# EAGLE board Welder_PSU (EAGLE 9.6.2), part 1 of 2
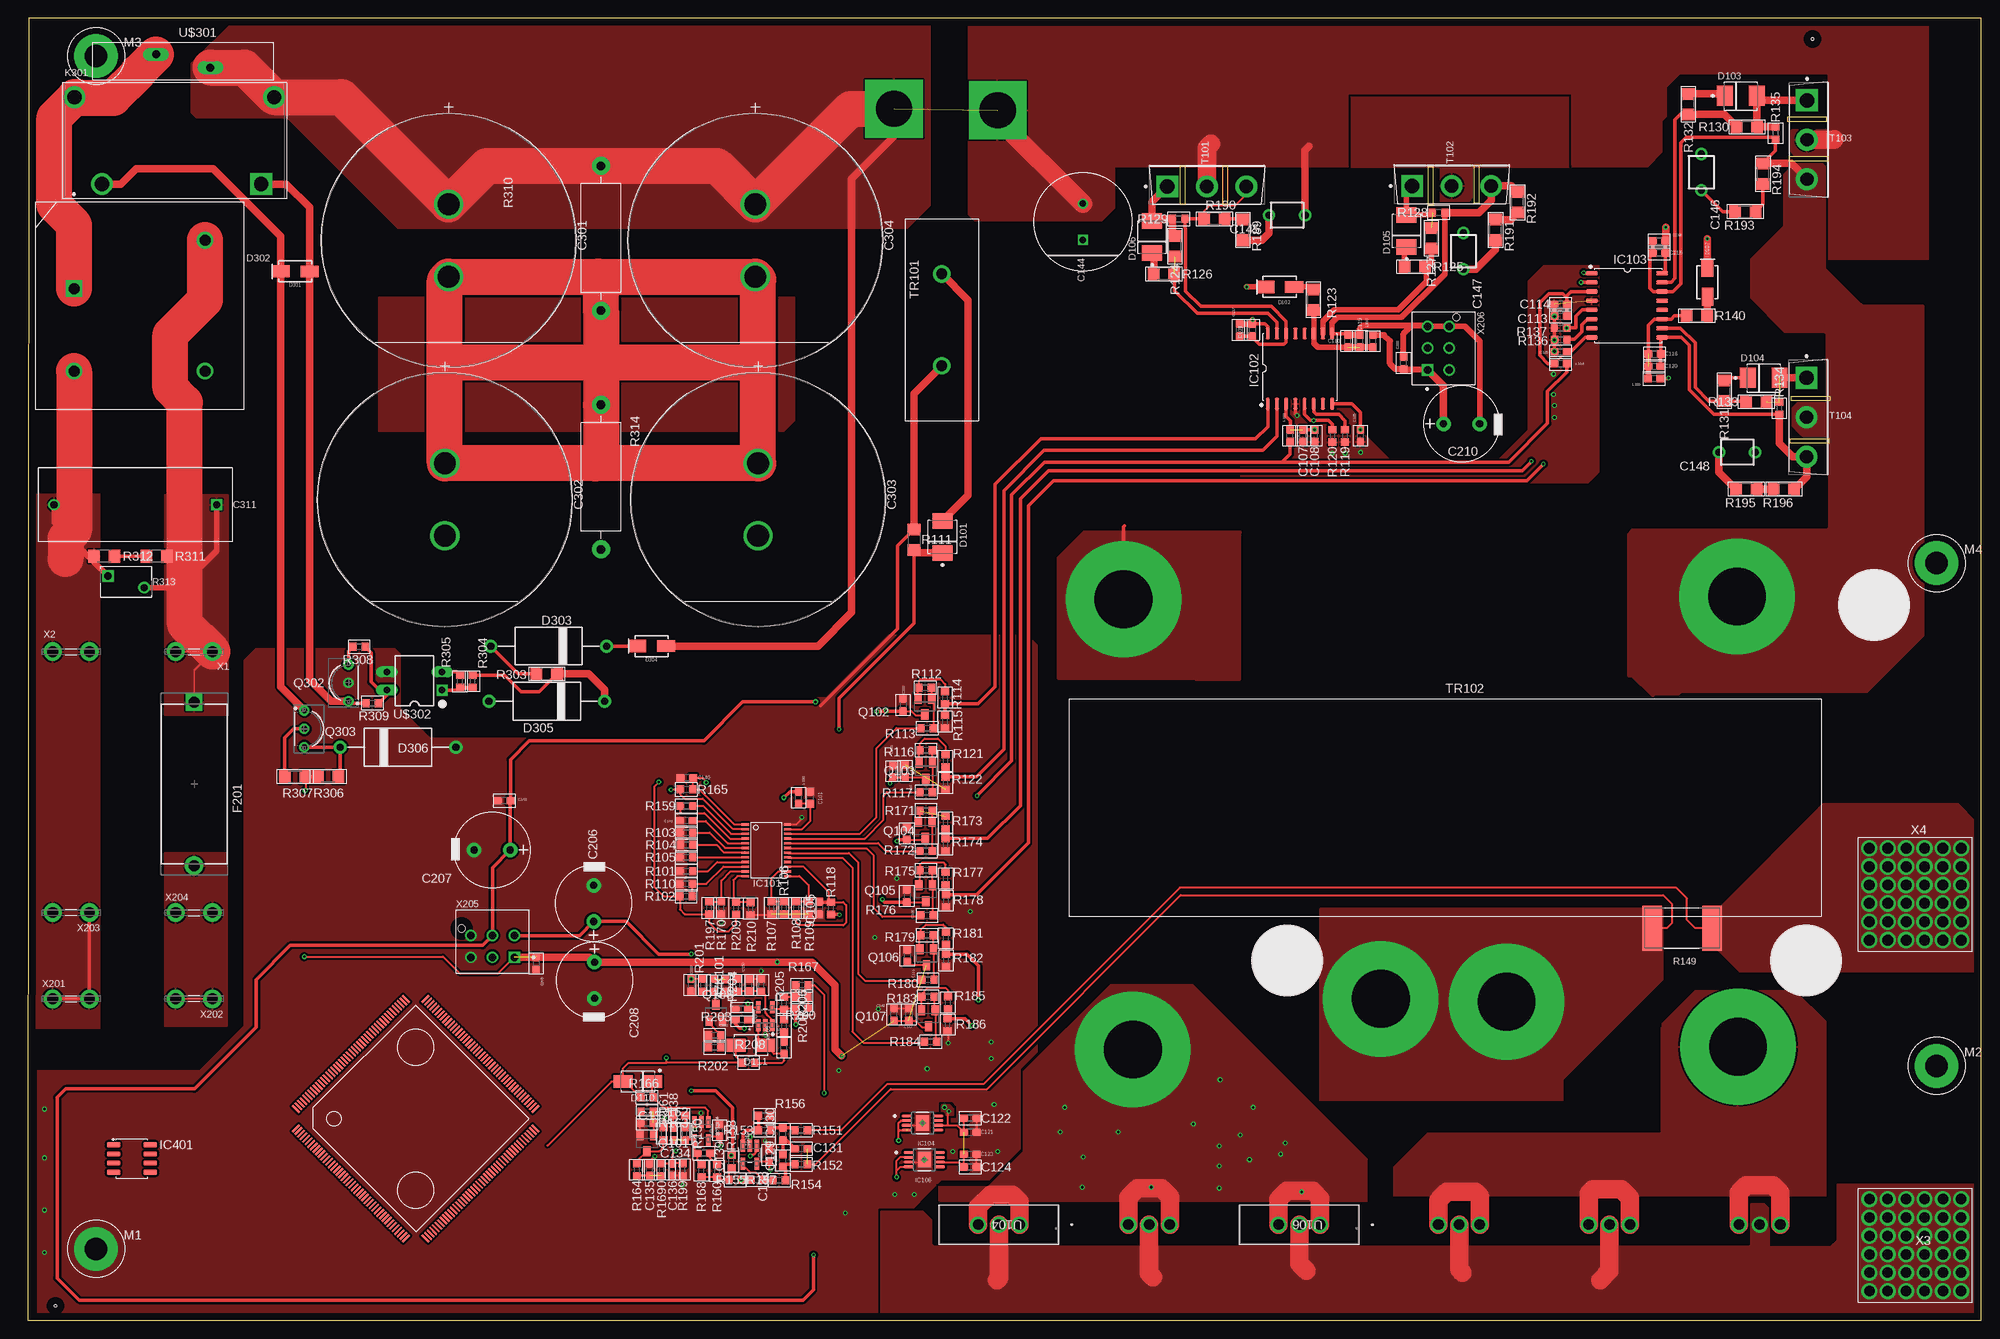
[diagram p6: board, top side]
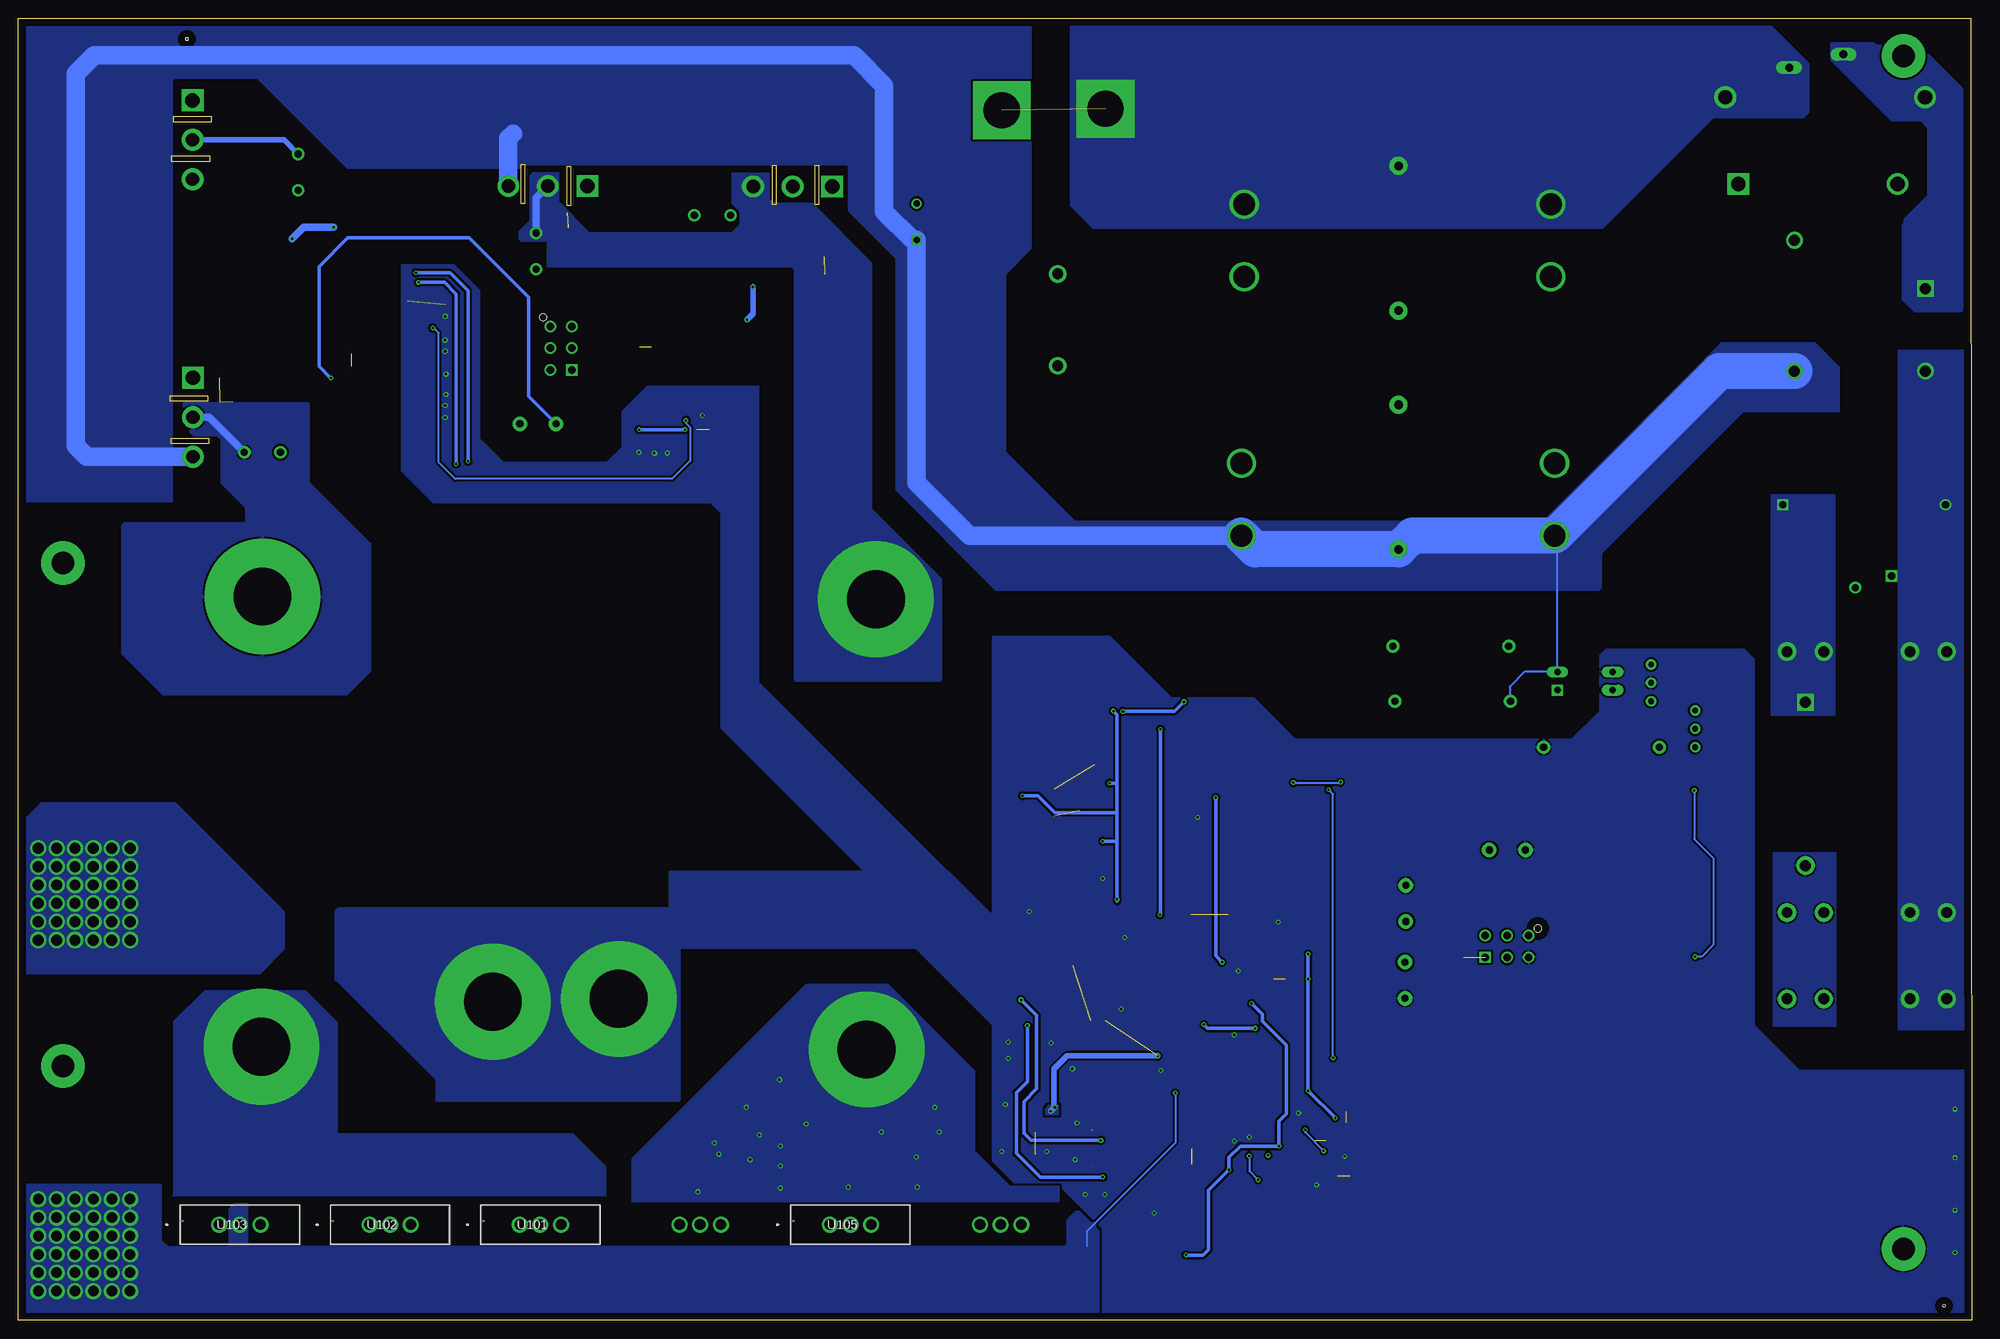
[diagram p7: board, bottom side, seen from below]

Size 270.13 x 180 mm. Coordinates in mm from the lower left corner, seen from the top.
Outline: 0,0.03 270.13,0 270.13,180 0.13,180 0,0.03
Copper layers (1*16): Top 0.07mm / dielectric 1.5mm / Bottom 0.07mm
Design rules "default *": minimum track width 0.2mm, minimum drill 0.3mm, track to track 0.3mm, track to pad 0.3mm, pad to pad 0.3mm, via to via 0.3mm, smd to smd 0mil, copper to edge 40mil, drill to drill 6mil, minimum pad ring 0.2mm, minimum via ring 0.15mm, stop-mask expansion 4mil, vias tented up to drill 0mil, thermal gap 10mil
Net classes: 1 HV-L: clearance 0.254 mm to class 0; 2 HV-N: clearance 0.254 mm to class 0, clearance 1.016 mm to class 1; 3 LV: clearance 0.203 mm to class 0, clearance 1.016 mm to class 1, clearance 1.016 mm to class 2; 4 HV-Plus: clearance 0.254 mm to class 0, clearance 1.016 mm to class 1, clearance 1.016 mm to class 2, clearance 1.016 mm to class 3; 5 HV-Minus: clearance 0.254 mm to class 0, clearance 1.016 mm to class 1, clearance 1.016 mm to class 2, clearance 1.016 mm to class 3, clearance 1.016 mm to class 4
Holes 0.35 mm at 246.76,177.16 3.81,2.03
Milling: 32 lines

## Footprints (pad centres in the part's own frame; a part is rotated, then mirrored left to right if it is on the bottom)
R0603 = smd 1 x 1.1: 1 -0.85,0; 2 0.85,0
0603 = smd 1.1 x 1: 1 -0.85,0; 2 0.85,0
C0603 = smd 1.1 x 1: 1 -0.85,0; 2 0.85,0
RADIAL_D13.0P5.0H25.0 = drill 0.9 pad 1.4 square: 1 -2.5,0 | drill 0.9 pad 1.4: 2 2.5,0
CAP_DISC_P5H13 = drill 1 pad 1.7: 1 -2.5,0; 2 2.5,0
CAPACITOR-ELKO-RM5-10X16 = drill 1 pad 2: 1 -2.5,0; 2 2.5,0
CAP_SLP152M250H9P3_MODIFIED = drill 3 pad 3.8: 1 0,0; 2 10.008,0
KEMET_R49AN347050B1M_0 = drill 1 pad 1.55 square: 1 -11.25,0 | drill 1 pad 1.55: 2 11.25,0
SMB = smd 2.159 x 2.743: 1 -2.21,0; 2 2.21,0
SMA-DIODE = smd 2.5 x 1.6: A -2,0 | smd 2.5 x 1.7: C 2,0
SMA = smd 2.65 x 1.75: 1 -2.015,0; 2 2.015,0
GBPC3510W_MODIFIED = drill 1.5 pad 2.3 square: 1 -2.35,-9.05 | drill 1.5 pad 2.3: 2 9.05,-9.05; 3 9.05,9.05; 4 -9.05,9.05
DO-201AD = drill 1 pad 1.8: A -8,0; K 8,0
FUSE_RM22.6 = drill 1.5 pad 2.3 square: 1 -11.3,0 | drill 1.5 pad 2.54: 2 11.3,0
TSSOP24 = smd 0.305 x 0.991: 1 -3.575,-2.918; 2 -2.925,-2.918; 3 -2.275,-2.918; 4 -1.625,-2.918; 5 -0.975,-2.918; 6 -0.325,-2.918; 7 0.325,-2.918; 8 0.975,-2.918; 9 1.625,-2.918; 10 2.275,-2.918; 11 2.925,-2.918; 12 3.575,-2.918; 13 3.575,2.918; 14 2.925,2.918; 15 2.275,2.918; 16 1.625,2.918; 17 0.975,2.918; 18 0.325,2.918; 19 -0.325,2.918; 20 -0.975,2.918; 21 -1.625,2.918; 22 -2.275,2.918; 23 -2.925,2.918; 24 -3.575,2.918
SOIC16_HV = smd 1.65 x 0.6: 1 -4.855,4.445; 2 -4.855,3.175; 3 -4.855,1.905; 4 -4.855,0.635; 5 -4.855,-0.635; 6 -4.855,-1.905; 7 -4.855,-3.175; 8 -4.855,-4.445; 9 4.855,-4.445; 10 4.855,-3.175; 11 4.855,-1.905; 12 4.855,-0.635; 13 4.855,0.635; 14 4.855,1.905; 15 4.855,3.175; 16 4.855,4.445
VSSOP-8 = smd 1.4 x 0.45: 1 -2.151,0.975; 2 -2.151,0.325; 3 -2.151,-0.325; 4 -2.151,-0.975; 5 2.151,-0.975; 6 2.151,-0.325; 7 2.151,0.325; 8 2.151,0.975 | smd 1.8 x 2.15: 3-2 0,0
SOT-23-5 = smd 1.626 x 0.61: 1 -1.245,0.95; 2 -1.245,0; 3 -1.245,-0.95; 4 1.245,-0.95; 5 1.245,0.95
SOIC8 = smd 1.9 x 0.72: 1 -2.54,1.905; 2 -2.54,0.635; 3 -2.54,-0.635; 4 -2.54,-1.905; 5 2.54,-1.905; 6 2.54,-0.635; 7 2.54,0.635; 8 2.54,1.905
PANASONIC_ALFG2PF09_0_MODIFIED = drill 2 pad 2.6 square: 1 0,0 | drill 2 pad 2.6: 2 22,0; 3 -1.8,-12; 4 25.8,-12
PCB_SCREW_M3_POWER = drill 3.1 pad 6: 1 0,0
THT_PAD_D5.0 = drill 5 pad 8 square: P$1 0,0
SOT23 = smd 1 x 1.4: 1 -0.95,-1.1; 2 0.95,-1.1; 3 0,1.1
TO-92 = drill 0.8 pad 1.4: 1 0,2.54; 2 0,0; 3 0,-2.54
R1206 = smd 1.6 x 1.803: 1 -1.422,0; 2 1.422,0
WSLP3921 = smd 2.7 x 6.2: 1 -4.15,0; 2 4.15,0
RES-RM20-RSF3W = drill 1.2 pad 2.5: 1 -10,0; 2 10,0
EPCOS_B72205S0271K101_MODIFIED = drill 1 pad 1.6 square: 1 -2.5,0.8 | drill 1 pad 1.6: 2 2.5,-0.8
TO-247AC_MODIFIED = drill 2 pad 3 square: 1 -0.227,5.46 | drill 1.85 pad 3: 2 -0.227,0; 3 -0.227,-5.46
CST206-2A_MODIFIED = drill 1.5 pad 2.4: 1 -6.35,0; 2 6.35,0
TOROID_B64290A0705X830 = drill 8 pad 16: 1 -29.21,40.386; 2 -28.829,-44.45; 3 33.02,40.513; 4 26.797,8.509; 5 26.416,-8.89; 6 33.401,-43.18
TO-247AD_VIS = drill 1.473 pad 1.981: 1 0,0; 2 2.845,0; 3 5.715,0
LQFP176_24X24 = smd 1.372 x 0.254: 1 -12.675,10.75; 2 -12.675,10.25; 3 -12.675,9.75; 4 -12.675,9.25; 5 -12.675,8.75; 6 -12.675,8.25; 7 -12.675,7.75; 8 -12.675,7.25; 9 -12.675,6.75; 10 -12.675,6.25; 11 -12.675,5.75; 12 -12.675,5.25; 13 -12.675,4.75; 14 -12.675,4.25; 15 -12.675,3.75; 16 -12.675,3.25; 17 -12.675,2.75; 18 -12.675,2.25; 19 -12.675,1.75; 20 -12.675,1.25; 21 -12.675,0.75; 22 -12.675,0.25; 23 -12.675,-0.25; 24 -12.675,-0.75; 25 -12.675,-1.25; 26 -12.675,-1.75; 27 -12.675,-2.25; 28 -12.675,-2.75; 29 -12.675,-3.25; 30 -12.675,-3.75; 31 -12.675,-4.25; 32 -12.675,-4.75; 33 -12.675,-5.25; 34 -12.675,-5.75; 35 -12.675,-6.25; 36 -12.675,-6.75; 37 -12.675,-7.25; 38 -12.675,-7.75; 39 -12.675,-8.25; 40 -12.675,-8.75; 41 -12.675,-9.25; 42 -12.675,-9.75; 43 -12.675,-10.25; 44 -12.675,-10.75; 89 12.675,-10.75; 90 12.675,-10.25; 91 12.675,-9.75; 92 12.675,-9.25; 93 12.675,-8.75; 94 12.675,-8.25; 95 12.675,-7.75; 96 12.675,-7.25; 97 12.675,-6.75; 98 12.675,-6.25; 99 12.675,-5.75; 100 12.675,-5.25; 101 12.675,-4.75; 102 12.675,-4.25; 103 12.675,-3.75; 104 12.675,-3.25; 105 12.675,-2.75; 106 12.675,-2.25; 107 12.675,-1.75; 108 12.675,-1.25; 109 12.675,-0.75; 110 12.675,-0.25; 111 12.675,0.25; 112 12.675,0.75; 113 12.675,1.25; 114 12.675,1.75; 115 12.675,2.25; 116 12.675,2.75; 117 12.675,3.25; 118 12.675,3.75; 119 12.675,4.25; 120 12.675,4.75; 121 12.675,5.25; 122 12.675,5.75; 123 12.675,6.25; 124 12.675,6.75; 125 12.675,7.25; 126 12.675,7.75; 127 12.675,8.25; 128 12.675,8.75; 129 12.675,9.25; 130 12.675,9.75; 131 12.675,10.25; 132 12.675,10.75 | smd 0.254 x 1.372: 45 -10.75,-12.675; 46 -10.25,-12.675; 47 -9.75,-12.675; 48 -9.25,-12.675; 49 -8.75,-12.675; 50 -8.25,-12.675; 51 -7.75,-12.675; 52 -7.25,-12.675; 53 -6.75,-12.675; 54 -6.25,-12.675; 55 -5.75,-12.675; 56 -5.25,-12.675; 57 -4.75,-12.675; 58 -4.25,-12.675; 59 -3.75,-12.675; 60 -3.25,-12.675; 61 -2.75,-12.675; 62 -2.25,-12.675; 63 -1.75,-12.675; 64 -1.25,-12.675; 65 -0.75,-12.675; 66 -0.25,-12.675; 67 0.25,-12.675; 68 0.75,-12.675; 69 1.25,-12.675; 70 1.75,-12.675; 71 2.25,-12.675; 72 2.75,-12.675; 73 3.25,-12.675; 74 3.75,-12.675; 75 4.25,-12.675; 76 4.75,-12.675; 77 5.25,-12.675; 78 5.75,-12.675; 79 6.25,-12.675; 80 6.75,-12.675; 81 7.25,-12.675; 82 7.75,-12.675; 83 8.25,-12.675; 84 8.75,-12.675; 85 9.25,-12.675; 86 9.75,-12.675; 87 10.25,-12.675; 88 10.75,-12.675; 133 10.75,12.675; 134 10.25,12.675; 135 9.75,12.675; 136 9.25,12.675; 137 8.75,12.675; 138 8.25,12.675; 139 7.75,12.675; 140 7.25,12.675; 141 6.75,12.675; 142 6.25,12.675; 143 5.75,12.675; 144 5.25,12.675; 145 4.75,12.675; 146 4.25,12.675; 147 3.75,12.675; 148 3.25,12.675; 149 2.75,12.675; 150 2.25,12.675; 151 1.75,12.675; 152 1.25,12.675; 153 0.75,12.675; 154 0.25,12.675; 155 -0.25,12.675; 156 -0.75,12.675; 157 -1.25,12.675; 158 -1.75,12.675; 159 -2.25,12.675; 160 -2.75,12.675; 161 -3.25,12.675; 162 -3.75,12.675; 163 -4.25,12.675; 164 -4.75,12.675; 165 -5.25,12.675; 166 -5.75,12.675; 167 -6.25,12.675; 168 -6.75,12.675; 169 -7.25,12.675; 170 -7.75,12.675; 171 -8.25,12.675; 172 -8.75,12.675; 173 -9.25,12.675; 174 -9.75,12.675; 175 -10.25,12.675; 176 -10.75,12.675
VARISTOR_D25_P7.5 = drill 1.1 pad 1.8 long: 1 -3.75,0.925; 2 3.75,-0.925
DIP04 = drill 0.9 pad 1.5 square: 1 -3.81,1.27 | drill 0.9 pad 1.5 long: 2 -3.81,-1.27; 3 3.81,-1.27; 4 3.81,1.27
TE_726386-2_MODIFIED = drill 1.5 pad 2.54: 1 -2.54,0; 1-2 2.54,0
X01_M10_7461061 = drill 1.45 pad 2.2: 1 -6.35,-6.35; 1-1 -3.81,-6.35; 1-2 -1.27,-6.35; 1-3 1.27,-6.35; 1-4 -6.35,-3.81; 1-5 -3.81,-3.81; 1-6 -1.27,-3.81; 1-7 1.27,-3.81; 1-8 -6.35,-1.27; 1-9 -3.81,-1.27; 1-10 -1.27,-1.27; 1-11 1.27,-1.27; 1-12 -6.35,1.27; 1-13 -3.81,1.27; 1-14 -1.27,1.27; 1-15 1.27,1.27; 1-16 3.81,-6.35; 1-17 3.81,-3.81; 1-18 3.81,-1.27; 1-19 3.81,1.27; 1-20 3.81,3.81; 1-21 1.27,3.81; 1-22 -1.27,3.81; 1-23 -3.81,3.81; 1-24 -6.35,3.81; 1-25 6.35,-1.27; 1-26 6.35,-3.81; 1-27 6.35,-6.35; 1-28 6.35,1.27; 1-29 6.35,3.81; 1-30 -6.35,6.35; 1-31 -3.81,6.35; 1-32 -1.27,6.35; 1-33 1.27,6.35; 1-34 3.81,6.35; 1-35 6.35,6.35
X01_M10_7461061_MODIFIED = drill 1.5 pad 2.25: 1 -6.35,-6.35; 1-1 -3.81,-6.35; 1-2 -1.27,-6.35; 1-3 1.27,-6.35; 1-4 -6.35,-3.81; 1-5 -3.81,-3.81; 1-6 -1.27,-3.81; 1-7 1.27,-3.81; 1-8 -6.35,-1.27; 1-9 -3.81,-1.27; 1-10 -1.27,-1.27; 1-11 1.27,-1.27; 1-12 -6.35,1.27; 1-13 -3.81,1.27; 1-14 -1.27,1.27; 1-15 1.27,1.27; 1-16 3.81,-6.35; 1-17 3.81,-3.81; 1-18 3.81,-1.27; 1-19 3.81,1.27; 1-20 3.81,3.81; 1-21 1.27,3.81; 1-22 -1.27,3.81; 1-23 -3.81,3.81; 1-24 -6.35,3.81; 1-25 6.35,-1.27; 1-26 6.35,-3.81; 1-27 6.35,-6.35; 1-28 6.35,1.27; 1-29 6.35,3.81; 1-30 -6.35,6.35; 1-31 -3.81,6.35; 1-32 -1.27,6.35; 1-33 1.27,6.35; 1-34 3.81,6.35; 1-35 6.35,6.35
MOLEX_206832-0601 = drill 1.02 pad 1.57 square: 1 3,-2.2 | drill 1.02 pad 1.57: 2 3,0.8; 3 0,-2.2; 4 0,0.8; 5 -3,-2.2; 6 -3,0.8 | hole 1.02: -4.28,1.78

## Placement (x,y rotation side)
47K101  [R0603]  98.11,46.35 90 top
C101  1µF/25V  [0603]  108.2,72.26 90 top
C102  100nF/50V  [0603]  121.03,85.09 270 top
C103  100nF/50V  [0603]  121.28,75.94 270 top
C104  100nF/50V  [0603]  121.54,67.31 270 top
C105  1nF 50V  [C0603]  109.47,57.02 270 top
C106  100nF/50V  [0603]  121.54,58.67 270 top
C107  100nF/100V  [0603]  176.33,122.3 90 top
C108  1uF/35V  [0603]  177.92,122.3 90 top
C109  2.2µF/25V  [0603]  169.29,136.91 270 top
C110  2.2µF/25V  [0603]  182.53,135.38 90 top
C111  100nF/50V  [0603]  121.59,50.42 270 top
C112  100nF/50V  [0603]  121.8,42.3 270 top
C113  100nF/100V  [0603]  211.96,138.85 0 top
C114  100nF/100V  [0603]  211.93,140.5 0 top
C115  2.2µF/25V  [0603]  225.55,147.57 180 top
C116  2.2µF/25V  [0603]  224.93,133.61 0 top
C117  100nF/100V  [0603]  167.56,136.9 90 top
C118  100nF/16V  [0603]  225.55,149.22 0 top
C119  2.2µF/25V  [0603]  184.2,135.38 90 top
C120  2.2µF/25V  [0603]  224.91,131.9 0 top
C121  1µF/25V  [0603]  130.3,26.04 0 top
C122  100nF/16V  [0603]  130.3,27.94 180 top
C123  1µF/25V  [0603]  130.3,22.99 0 top
C124  100nF/16V  [0603]  130.3,21.21 180 top
C125  100nF/100V  [0603]  184.25,122.3 90 top
C126  1uF/35V  [0603]  211.96,133.9 0 top
C129  1nF 50V  [0603]  104.39,22.1 90 top
C130  1nF 50V  [0603]  104.39,25.78 90 top
C131  100pF 50V  [0603]  106.93,23.75 180 top
C132  1nF 50V  [0603]  107,43.15 180 top
C133  100nF/16V  [0603]  102.49,22.86 90 top
C134  1nF 50V  [0603]  93.47,23.11 180 top
C135  100nF 50V  [0603]  85.98,20.83 90 top
C136  220nF 50V  [0603]  89.15,20.83 270 top
C137  1nF 50V  [0603]  90.04,28.32 0 top
C138  1nF 50V  [0603]  89.28,25.78 270 top
C139  100nF 25V  [0603]  95.63,26.29 90 top
C140  1µF/25V  [0603]  91.13,75 180 top
C141  100nF/100V  [0603]  91.06,69.09 180 top
C142  1uF/25V  [0603]  119.76,42.29 90 top
C143  1uF/25V  [0603]  65.89,71.86 180 top
C144  860011378008  [RADIAL_D13.0P5.0H25.0]  145.89,151.88 90 top
C145  FG26X7R2J472KNT06  [CAP_DISC_P5H13]  174.12,152.78 180 top
C146  FG26X7R2J472KNT06  [CAP_DISC_P5H13]  231.39,158.75 270 top
C147  FG26X7R2J472KNT06  [CAP_DISC_P5H13]  198.5,147.83 270 top
C148  FG26X7R2J472KNT06  [CAP_DISC_P5H13]  236.35,120.02 180 top
C149  100nF 50V  [0603]  96.44,46.3 270 top
C150  220nF 50V  [0603]  99.75,46.35 90 top
C151  1nF 50V  [0603]  104.57,37.69 90 top
C152  1nF 50V  [0603]  98.7,41.61 180 top
C153  10nF 25V  [0603]  98.7,43.03 180 top
C201  100nF/ 100V  [0603]  119.63,75.93 90 top
C202  100nF/ 100V  [0603]  91.69,46.35 270 top
C203  100nF/ 100V  [0603]  190.22,132.36 90 top
C205  100nF/ 100V  [0603]  70.28,49.36 270 top
C206  50PX470MEFC10X20  [CAPACITOR-ELKO-RM5-10X16]  78.23,57.66 90 top
C207  50PX470MEFC10X20  [CAPACITOR-ELKO-RM5-10X16]  64.2,65.05 180 top
C208  50PX470MEFC10X20  [CAPACITOR-ELKO-RM5-10X16]  78.36,47.03 270 top
C210  50PX470MEFC10X20  [CAPACITOR-ELKO-RM5-10X16]  198.25,123.95 0 top
C301  C_1500UFCAP_SLP152M250H9P3_MODIFIED  [CAP_SLP152M250H9P3_MODIFIED]  58.17,154.31 270 top
C302  C_1500UFCAP_SLP152M250H9P3_MODIFIED  [CAP_SLP152M250H9P3_MODIFIED]  57.66,118.49 270 top
C303  C_1500UFCAP_SLP152M250H9P3_MODIFIED  [CAP_SLP152M250H9P3_MODIFIED]  100.96,118.49 270 top
C304  C_1500UFCAP_SLP152M250H9P3_MODIFIED  [CAP_SLP152M250H9P3_MODIFIED]  100.58,154.31 270 top
C311  R49AN347050B1MKEMET_R49AN347050B1M_0_0  [KEMET_R49AN347050B1M_0]  14.86,112.78 180 top
D101  STTH1R04U  [SMB]  126.47,108.32 90 top
D102  RS1M-13-F  [SMA-DIODE]  173.1,142.88 180 top
D103  STTH1R04U  [SMB]  236.86,169.29 0 top
D104  STTH1R04U  [SMB]  240.03,130.3 0 top
D105  STTH1R04U  [SMB]  190.63,150.62 90 top
D106  STTH1R04U  [SMB]  155.45,149.75 90 top
D107  RS1M-13-F  [SMA-DIODE]  232.23,143.54 90 top
D110  SS14  [SMA]  84.33,33.02 180 top
D111  SS14  [SMA]  99.95,38.05 180 top
D301  RS1M-13-F  [SMA-DIODE]  36.96,145.03 180 top
D302  GBPC3510W1.5MM_DRILL  [GBPC3510W_MODIFIED]  15.44,140.28 270 top
D303  1N5387BRLG  [DO-201AD]  72.01,93.22 0 top
D304  RS1M-13-F  [SMA-DIODE]  86.23,93.22 180 top
D305  BZX79C9V1  [DO-201AD]  71.75,85.6 0 top
D306  BZX79C9V1  [DO-201AD]  51.18,79.25 180 top
F201  696101000002  [FUSE_RM22.6]  22.99,74.17 270 top
IC101  UCC28951PWR  [TSSOP24]  102.13,65 270 top
IC102  UCC21542DWK  [SOIC16_HV]  175.9,131.57 90 top
IC103  UCC21542DWK  [SOIC16_HV]  221.13,140.33 0 top
IC104  UCC27524DGNVSS  [VSSOP-8]  123.7,27.3 0 top
IC105  OPA378AIDBVR  [SOT-23-5]  101.98,42.04 90 top
IC106  UCC27524DGNVSS  [VSSOP-8]  123.95,22.23 0 top
IC108  OPA378AIDBVR  [SOT-23-5]  93.13,26.2 270 top
IC401  SN65HVD3082EDR  [SOIC8]  14.39,22.39 0 top
K301  PANASONIC_ALFG2PF09_MODIFIED  [PANASONIC_ALFG2PF09_0_MODIFIED]  32.26,157.1 180 top
L102  BLM18RK601SN1D  [0603]  174.54,122.3 90 top
L103  BLM18RK601SN1D  [0603]  185.98,135.38 90 top
L104  BLM18RK601SN1D  [0603]  211.94,132.28 0 top
L105  BLM18RK601SN1D  [0603]  224.88,130.21 180 top
L108  BLM18RK601SN1D  [0603]  106.56,72.26 90 top
M1  M_HOLE_3M  [PCB_SCREW_M3_POWER]  9.43,9.9 0 top
M2  M_HOLE_3M  [PCB_SCREW_M3_POWER]  263.93,35.2 0 top
M3  M_HOLE_3M  [PCB_SCREW_M3_POWER]  9.43,174.8 0 top
M4  M_HOLE_3M  [PCB_SCREW_M3_POWER]  263.93,104.7 0 top
PAD101  THT_PAD_5MM  [THT_PAD_D5.0]  119.76,167.5 90 top
PAD102  THT_PAD_5MM  [THT_PAD_D5.0]  134.11,167.29 0 top
Q101  2N7002  [SOT23]  85.6,24.51 180 top
Q102  2N7002  [SOT23]  124.03,84.87 180 top
Q103  2N7002  [SOT23]  124.15,75.99 180 top
Q104  2N7002  [SOT23]  124.08,67.82 180 top
Q105  2N7002  [SOT23]  124.14,59.07 180 top
Q106  2N7002  [SOT23]  124.27,50.21 180 top
Q107  2N7002  [SOT23]  124.52,41.79 180 top
Q108  2N7002  [SOT23]  95.12,42.55 0 top
Q302  KSD1616AYTA  [TO-92]  38.23,81.79 0 top
Q303  BC640TA  [TO-92]  44.32,88.14 180 top
R101  100K 1%  [R0603]  91.06,62.1 180 top
R102  100K 1%  [R0603]  91.01,58.65 0 top
R103  10K 1%  [R0603]  91.06,67.44 0 top
R104  10K 1%  [R0603]  91.08,65.74 0 top
R105  100K 1%  [R0603]  91.06,64.03 0 top
R106  0R 1%  [R0603]  104.55,57.02 90 top
R107  10K 1%  [R0603]  102.82,57.03 90 top
R108  0R 1%  [R0603]  106.25,57.02 90 top
R109  10K 1%  [R0603]  107.95,57.02 90 top
R110  49K9 1%  [R0603]  91.03,60.35 0 top
R111  10R 1%  [R1206]  122.53,107.95 90 top
R112  100R 1%  [R0603]  124.07,87.47 180 top
R113  10R 1%  [R0603]  124.35,81.87 0 top
R114  330R  [R0603]  126.83,86.1 90 top
R115  10K 1%  [R0603]  126.83,82.8 270 top
R116  100R 1%  [R0603]  124.2,78.84 180 top
R117  10R 1%  [R0603]  124.2,73.05 0 top
R118  22R 1%  [R0603]  111.03,56.97 270 top
R119  10K  [R0603]  182.13,122.3 270 top
R120  10K  [R0603]  180.38,122.28 270 top
R121  330R  [R0603]  126.86,77.35 90 top
R122  10K 1%  [R0603]  126.89,74.29 270 top
R123  2R2 1%  [R1206]  177.76,141.1 90 top
R124  2R2 1%  [R1206]  158.63,148.49 270 top
R125  2R2 1%  [R1206]  191.77,145.67 0 top
R126  2R2 1%  [R1206]  157.1,144.65 0 top
R127  2R2 1%  [R1206]  194.06,149.61 270 top
R128  49K9  [R0603]  195.07,153.16 180 top
R129  49K9  [R0603]  159.13,152.27 180 top
R130  2R2 1%  [R1206]  237.71,165 180 top
R131  2R2 1%  [R1206]  234.57,128.52 270 top
R132  2R2 1%  [R1206]  229.62,168.15 270 top
R133  2R2 1%  [R1206]  239.01,127 180 top
R134  49K9  [R0603]  242.19,126.11 90 top
R135  49K9  [R0603]  241.66,164.12 90 top
R136  10K  [R0603]  211.96,135.55 180 top
R137  10K  [R0603]  211.93,137.2 180 top
R140  2R2 1%  [R1206]  230.77,138.9 0 top
R149  WSL5931L3000FEA  [WSLP3921]  228.73,54.23 0 top
R150  100k 1%  [R0603]  90.8,25.78 90 top
R151  590R 1%  [R0603]  106.93,26.29 0 top
R152  590R 1%  [R0603]  106.93,21.57 0 top
R153  412R 1%  [R0603]  101.85,26.29 180 top
R154  412R 1%  [R0603]  103.89,19.39 180 top
R155  47K 1%  [R0603]  100.84,19.43 0 top
R156  47K 1%  [R0603]  101.85,28.32 180 top
R157  1K2 1%  [R0603]  97.79,19.43 0 top
R158  10K 1%  [R0603]  97.27,21.97 270 top
R159  0R 1%  [R0603]  91.06,71.12 180 top
R160  [R0603]  95.28,20.68 270 top
R161  1k  [R0603]  87.91,25.83 90 top
R162  10K 1%  [R0603]  85.63,28.83 180 top
R163  10K 1%  [R0603]  85.63,27.3 0 top
R164  100K  [R0603]  84.2,20.83 90 top
R165  18K 1%  [R0603]  91.06,73.41 180 top
R166  0R 1%  [R0603]  85.6,30.86 0 top
R167  1K2 1%  [R0603]  107.03,46.35 0 top
R168  18k 1%  [R0603]  93.13,20.7 90 top
R170  10k 1%  [R0603]  95.88,57.02 90 top
R171  100R 1%  [R0603]  124.2,70.48 180 top
R172  10R 1%  [R0603]  124.2,64.9 0 top
R173  330R  [R0603]  126.89,68.84 90 top
R174  10K 1%  [R0603]  126.87,65.78 270 top
R175  100R 1%  [R0603]  124.2,62.25 180 top
R176  10R 1%  [R0603]  124.33,55.99 0 top
R177  330R  [R0603]  126.91,61.09 90 top
R178  10K 1%  [R0603]  126.97,58.03 270 top
R179  100R 1%  [R0603]  124.33,53.25 180 top
R180  10R 1%  [R0603]  124.46,47.08 0 top
R181  330R  [R0603]  126.93,52.84 90 top
R182  10K 1%  [R0603]  126.95,49.78 270 top
R183  100R 1%  [R0603]  124.45,44.77 180 top
R184  10R 1%  [R0603]  124.84,38.55 0 top
R185  330R  [R0603]  127.2,43.95 90 top
R186  10K 1%  [R0603]  127.19,40.89 270 top
R189  10K  [R1206]  168.02,150.75 270 top
R190  10K  [R1206]  164.08,152.27 0 top
R191  10K  [R1206]  202.95,150.75 270 top
R192  10K  [R1206]  205.99,154.56 270 top
R193  10K  [R1206]  237.49,153.29 180 top
R194  10K  [R1206]  239.93,158.52 270 top
R195  10K  [R1206]  237.62,114.94 180 top
R196  10K  [R1206]  242.82,114.94 180 top
R197  10k 1%  [R0603]  94.21,57.02 90 top
R199  100K 1%  [R0603]  90.55,20.85 90 top
R200  [R0603]  107.02,44.74 180 top
R201  1k  [R0603]  93.34,46.35 90 top
R202  10K 1%  [R0603]  94.95,37.74 180 top
R203  10K 1%  [R0603]  94.95,39.45 0 top
R204  100K  [R0603]  94.87,46.33 270 top
R205  100K  [R0603]  101.41,46.35 270 top
R206  18k 1%  [R0603]  104.55,43.84 270 top
R207  100k 1%  [R0603]  104.58,40.72 270 top
R208  0R 1%  [R0603]  99.65,35.61 0 top
R209  10k 1%  [R0603]  97.93,56.98 90 top
R210  0R 1%  [R0603]  99.92,56.94 270 top
R303  82K, 1%  [R1206]  71.75,89.41 180 top
R304  36K,5%  [R0603]  61.49,88.37 270 top
R305  100K,5%  [R0603]  59.74,88.34 90 top
R306  100R 1%  [R1206]  36.96,75.18 180 top
R307  1K 1%  [R1206]  41.53,75.18 0 top
R308  [R0603]  45.8,93.12 0 top
R309  [R0603]  47.62,85.34 0 top
R310  51K 5%  [RES-RM20-RSF3W]  79.25,149.61 90 top
R311  220K 5% CRCW1206220KJNEAHP  [R1206]  17.8,105.64 0 top
R312  220K 5% CRCW1206220KJNEAHP  [R1206]  10.57,105.64 0 top
R313  B72205S0271K1011  [EPCOS_B72205S0271K101_MODIFIED]  13.59,102.11 0 top
R314  51K 5%  [RES-RM20-RSF3W]  79.25,116.59 90 top
R1690  47K 1%  [R0603]  87.63,20.83 270 top
T101  SIHG039N60EF"  [TO-247AC_MODIFIED]  163.02,156.99 90 top
T102  SIHG039N60EF"  [TO-247AC_MODIFIED]  196.88,157.06 90 top
T103  SIHG039N60EF"  [TO-247AC_MODIFIED]  246.22,163.22 0 top
T104  SIHG039N60EF"  [TO-247AC_MODIFIED]  246.18,124.86 0 top
TR101  CST206-2A1.5MM-DRILL  [CST206-2A_MODIFIED]  126.37,138.33 270 top
TR102  TRANSFORMER-CUSTOM-PSFB  [TOROID_B64290A0705X830]  195.96,70.87 270 top
U101  FEP30DP-E3/45  [TO-247AD_VIS]  200.76,13.24 0 bottom
U102  FEP30DP-E3/45  [TO-247AD_VIS]  221.54,13.24 0 bottom
U103  FEP30DP-E3/45  [TO-247AD_VIS]  242.32,13.24 0 bottom
U104  FEP30DP-E3/45  [TO-247AD_VIS]  137.11,13.24 180 top
U105  FEP30DP-E3/45  [TO-247AD_VIS]  157.89,13.24 0 bottom
U106  FEP30DP-E3/45  [TO-247AD_VIS]  178.66,13.24 180 top
U401  S7G2LQFP176  [LQFP176_24X24]  53.62,27.89 45 top
U$101  OPA378AIDBVR  [SOT-23-5]  99.83,22.9 270 top
U$301  B57364S100M54  [VARISTOR_D25_P7.5]  21.46,174.12 0 top
U$302  PC817  [DIP04]  53.47,88.39 180 top
X1  726386-2  [TE_726386-2_MODIFIED]  22.99,92.46 0 top
X2  726386-2  [TE_726386-2_MODIFIED]  5.97,92.46 0 top
X3  7461061  [X01_M10_7461061]  260.99,10.41 0 top
X4  7461061"  [X01_M10_7461061_MODIFIED]  260.99,58.93 0 top
X201  726386-2  [TE_726386-2_MODIFIED]  5.97,44.45 0 top
X202  726386-2  [TE_726386-2_MODIFIED]  22.99,44.45 180 top
X203  726386-2  [TE_726386-2_MODIFIED]  5.97,56.39 180 top
X204  726386-2  [TE_726386-2_MODIFIED]  22.99,56.39 0 top
X205  MOLEX_206832-0601MOLEX_206832-0601  [MOLEX_206832-0601]  64.25,52.4 0 top
X206  MOLEX_206832-0601MOLEX_206832-0601  [MOLEX_206832-0601]  195.73,134.42 270 top